# EAGLE design neopixel v1 (EAGLE 9.7.0)
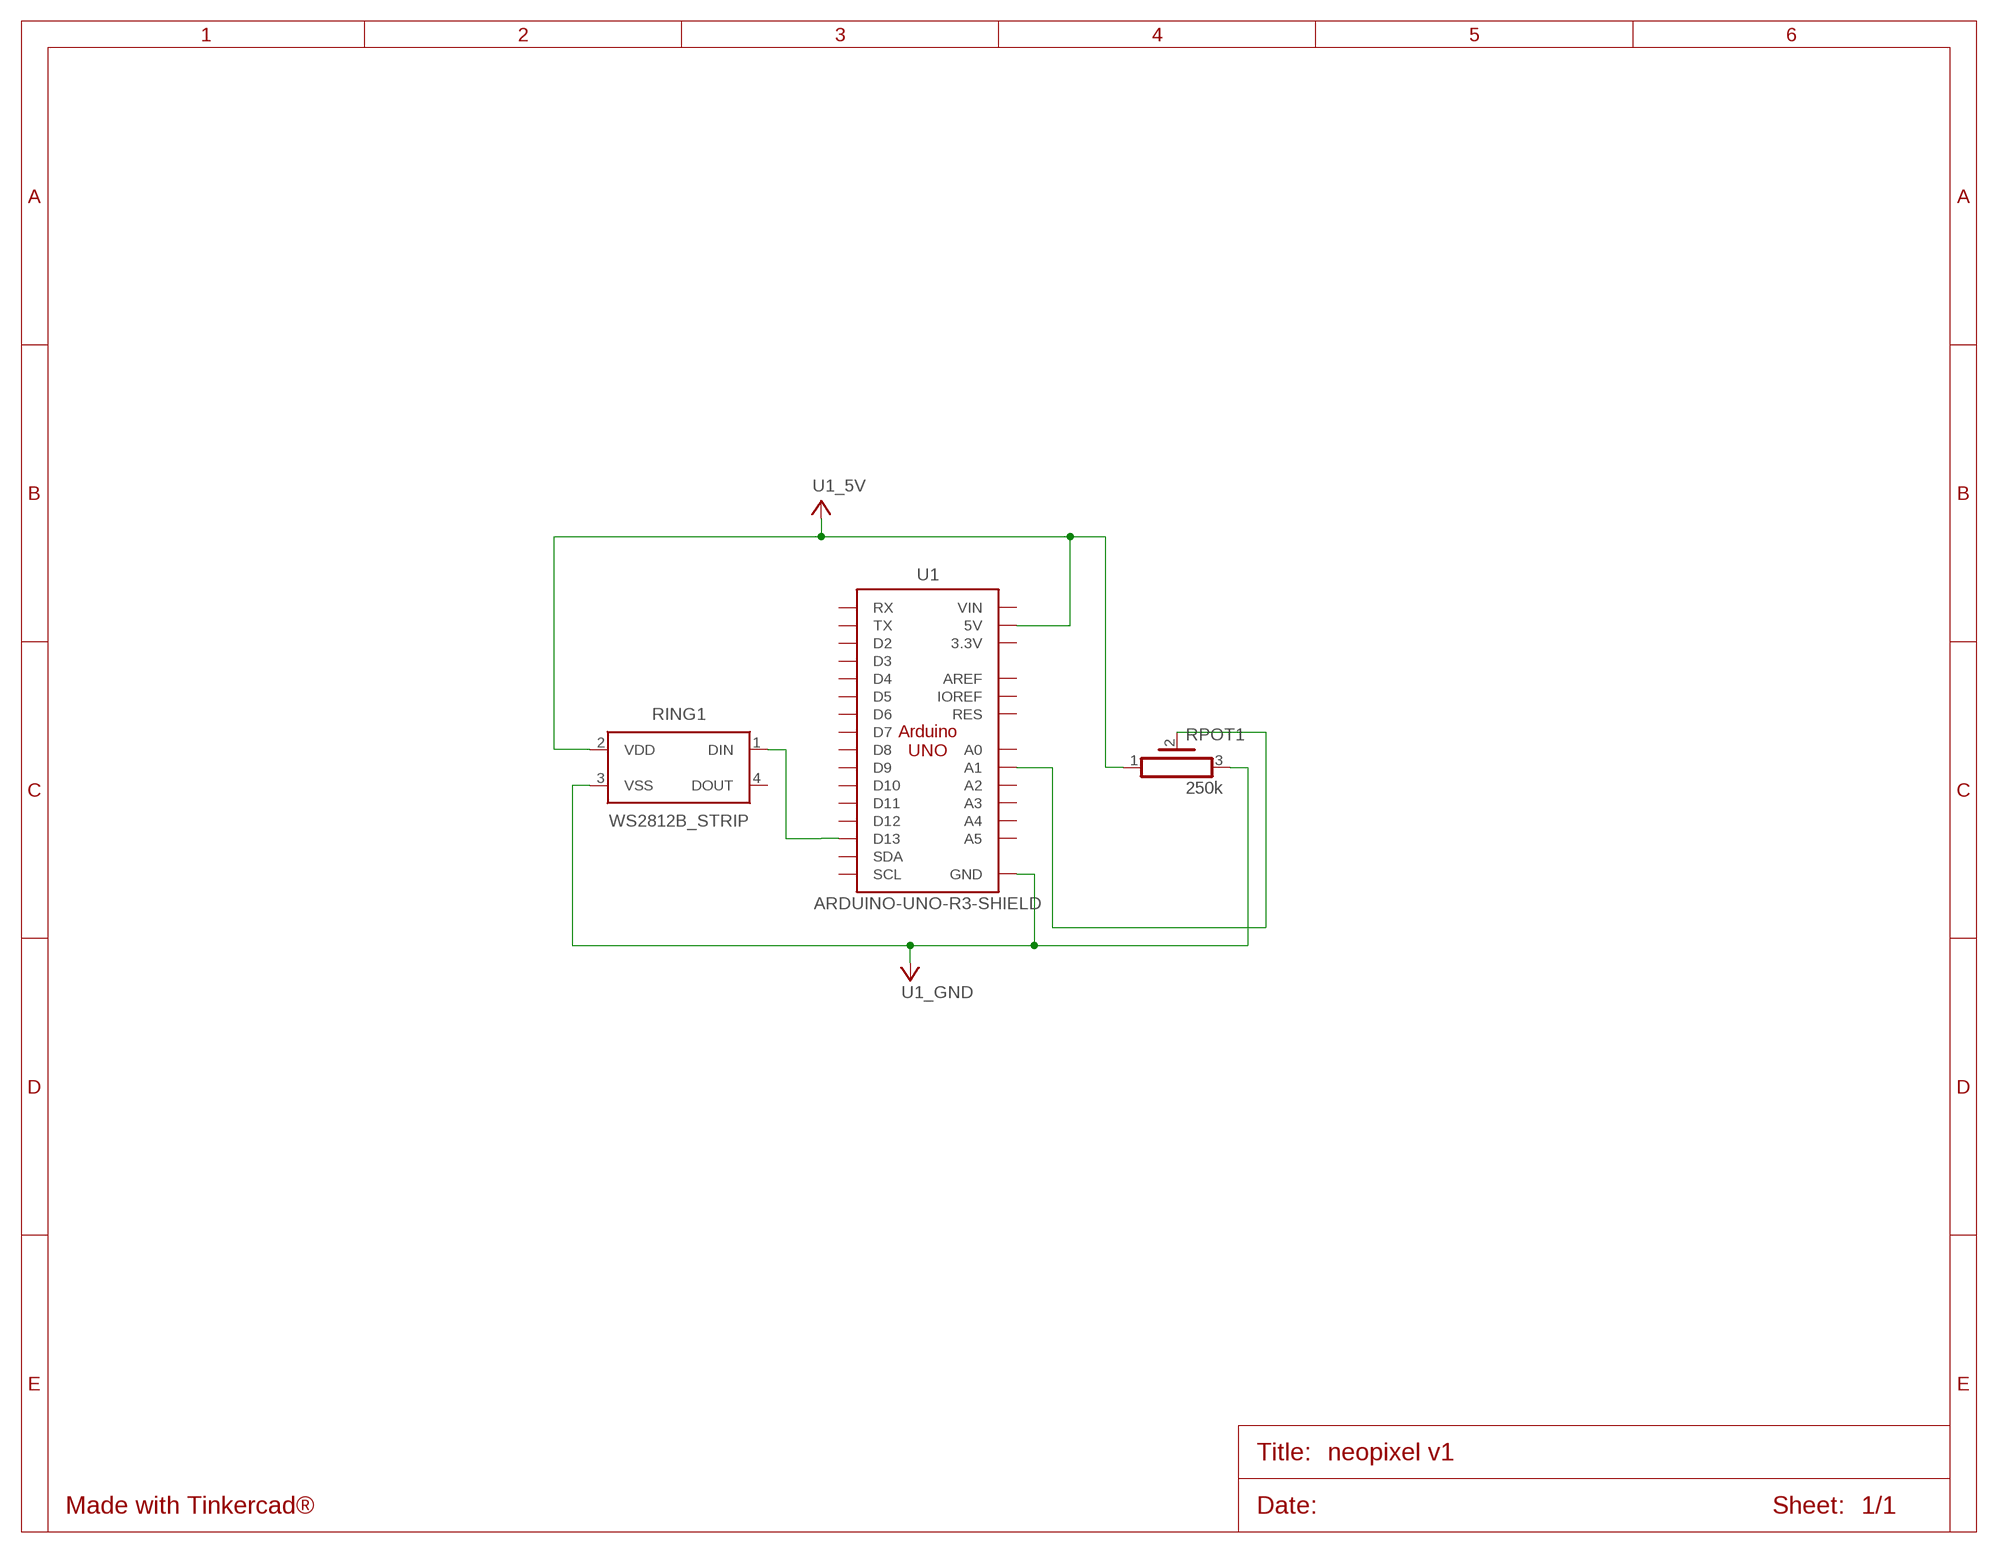
[diagram p0: schematic, sheet 1]

## Parts
RING1  WS2812B_STRIP  [WS2812-STRIP]
RPOT1  250k  POT_HA-06  [HA-06-SM065]
U1  ARDUINO-UNO-R3-SHIELD  [ARDUINO-UNO-R3-SHIELD]

## Nets
U1_5V: RING1.2(VDD) RPOT1.1 U1.5V
U1_A1: RPOT1.2 U1.A1
U1_D13: RING1.1(DIN) U1.D13
U1_GND: RING1.3(VSS) RPOT1.3 U1.GND@0(GND) U1.GND@1(GND) U1.GND@2(GND)
Unconnected: RING1.4(DOUT) U1.3.3V U1.A0 U1.A2 U1.A3 U1.A4 U1.A5 U1.AREF U1.D2 U1.D3 U1.D4 U1.D5 U1.D6 U1.D7 U1.D8 U1.D9 U1.D10 U1.D11 U1.D12 U1.IOREF U1.RES U1.RX U1.SCL U1.SDA U1.TX U1.VIN

## Library data of the parts
RING1 = Tinkercad:WS2812B: Intelligent control LED integrated light source Datasheet <http://cdn.sparkfun.com/datasheets/BreakoutBoards/WS2812B.pdf>
RPOT1 = Tinkercad:POT: Rectangular Trimmer Potentiometers - PV36 Series Datasheet <https://www.bourns.com/docs/Product-Datasheets/pv36.pdf>
U1 = Tinkercad:ARDUINO-UNO-R3-SHIELD

## Board
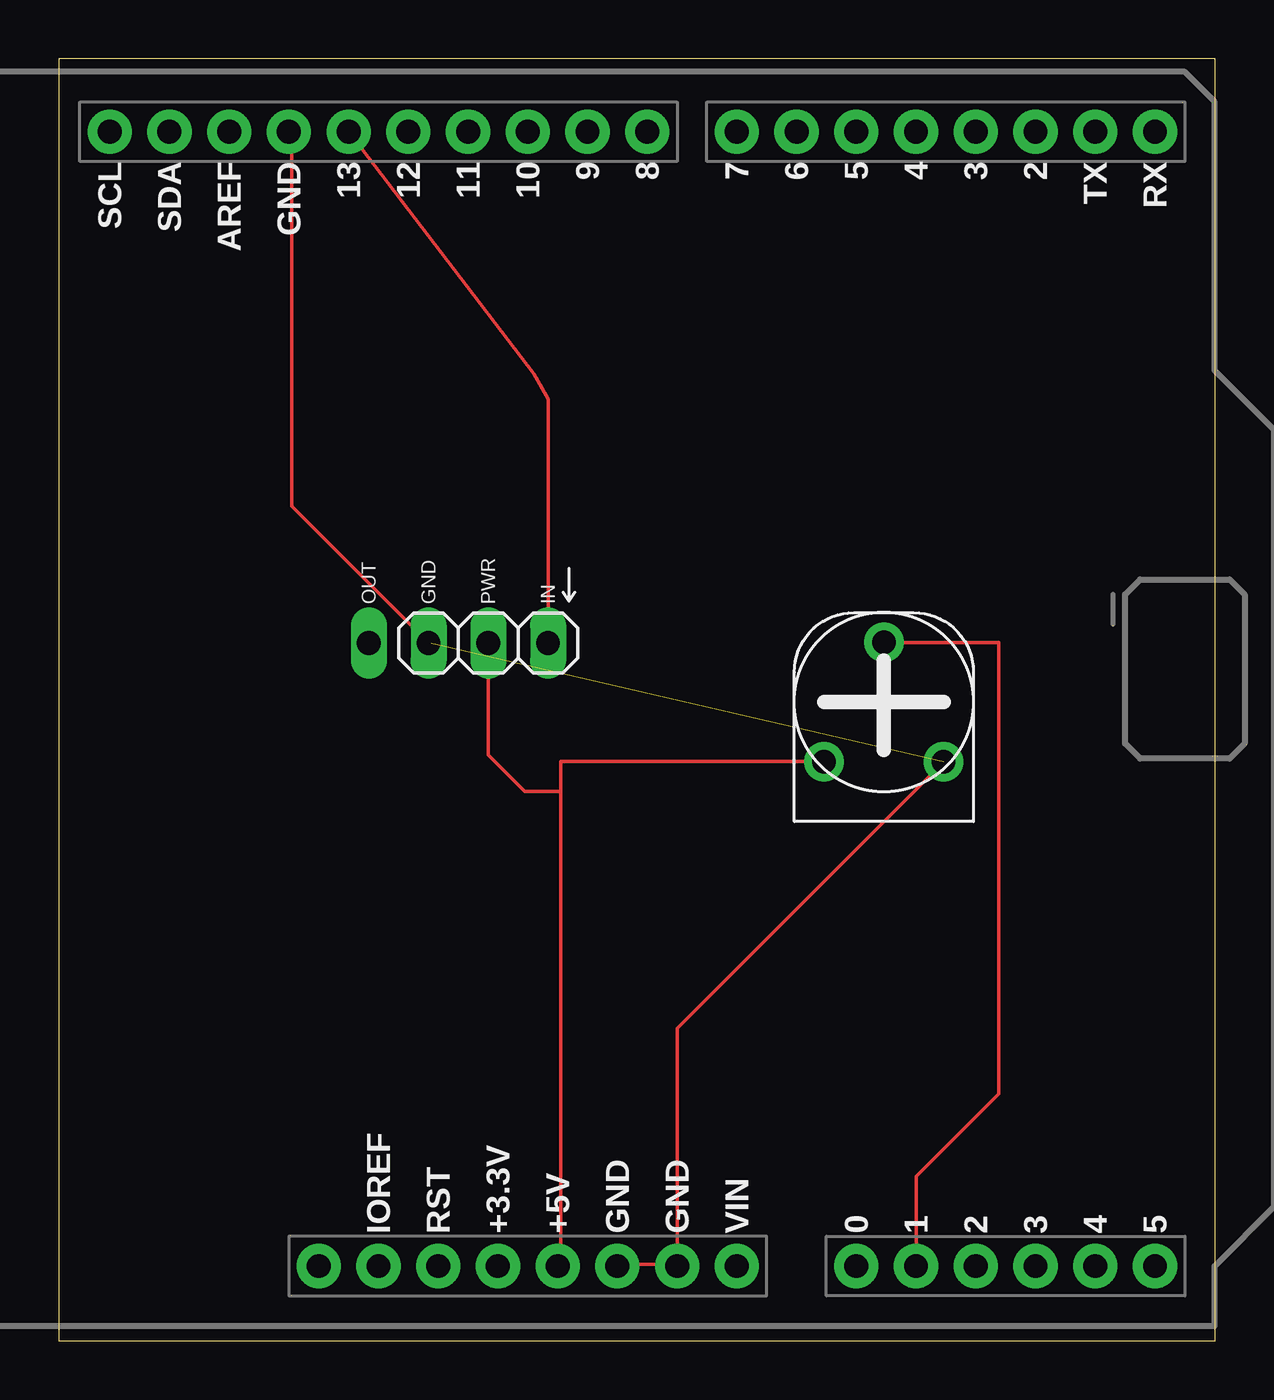
[diagram p1: board, top side]
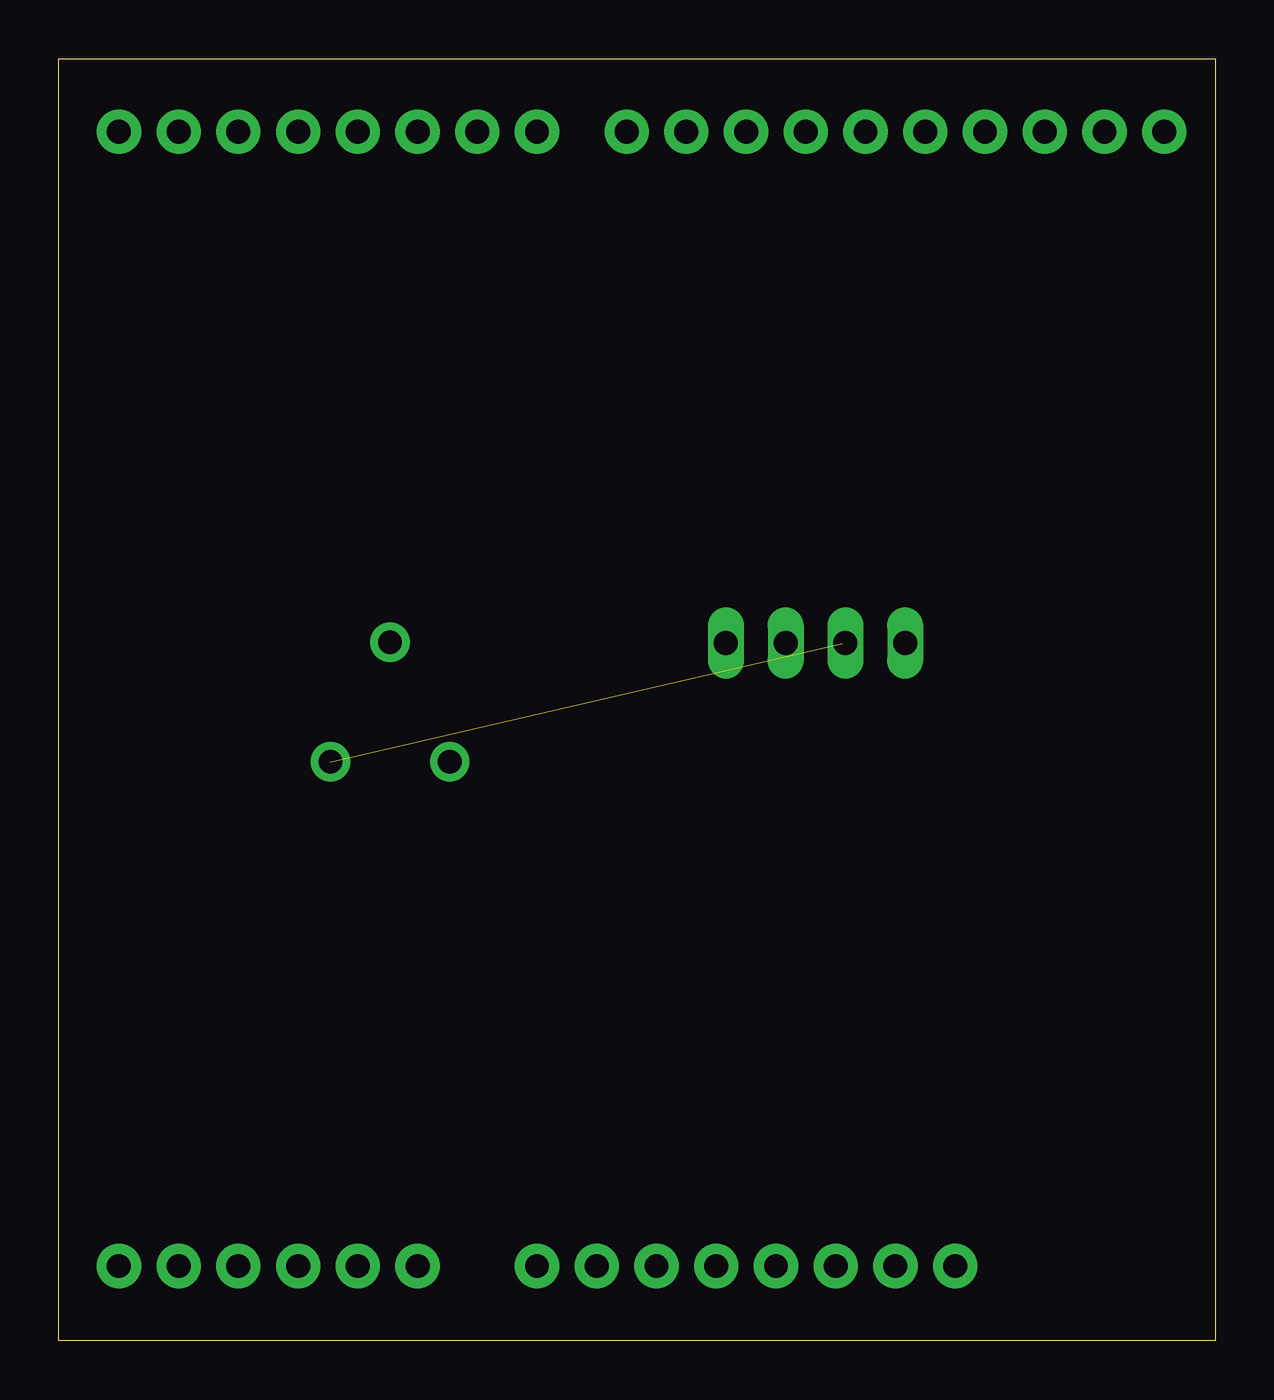
[diagram p2: board, bottom side, seen from below]

Size 49.17 x 54.54 mm. Coordinates in mm from the lower left corner, seen from the top.
Outline: 0,0 49.17,0 49.17,54.54 0,54.54 0,0
Copper layers (1*16): Top 0.035mm / dielectric 1.5mm / Bottom 0.035mm
Design rules "default": minimum track width 6mil, minimum drill 0.35mm, track to track 6mil, track to pad 6mil, pad to pad 6mil, via to via 6mil, smd to smd 6mil, copper to edge 40mil, drill to drill 6mil, minimum pad ring 10mil, minimum via ring 8mil, stop-mask expansion 4mil, vias tented up to drill 0mil, thermal gap 10mil

### Footprints (pad centres in the part's own frame; a part is rotated, then mirrored left to right if it is on the bottom)
WS2812-STRIP = drill 1.016 long: 1 -3.81,0; 2 -1.27,0; 3 1.27,0; 4 3.81,0
HA-06-SM065 = drill 1 pad 1.676: 1 -2.54,-2.54; 2 0,2.54; 3 2.54,-2.54
ARDUINO-UNO-R3-SHIELD = drill 1.016 pad 1.88: 3.3V 24.13,-2.54; 5V 24.13,0; A0 24.13,12.7; A1 24.13,15.24; A2 24.13,17.78; A3 24.13,20.32; A4 24.13,22.86; A5 24.13,25.4; AREF -24.13,-13.97; D2 -24.13,20.32; D3 -24.13,17.78; D4 -24.13,15.24; D5 -24.13,12.7; D6 -24.13,10.16; D7 -24.13,7.62; D8 -24.13,3.81; D9 -24.13,1.27; D10 -24.13,-1.27; D11 -24.13,-3.81; D12 -24.13,-6.35; D13 -24.13,-8.89; GND@0 24.13,2.54; GND@1 24.13,5.08; GND@2 -24.13,-11.43; IOREF 24.13,-7.62; NC 24.13,-10.16; RES 24.13,-5.08; RX -24.13,25.4; SCL -24.13,-19.05; SDA -24.13,-16.51; TX -24.13,22.86; VIN 24.13,7.62

### Placement (x,y rotation side)
RING1  16.99,29.68 180 top
RPOT1  35.09,27.17 0 top
U1  21.21,27.3 270 top

### Tracks (layer width: path | path; a pad name or v marks a point on that pad's centre or on a via)
U1_5V
  Top 0.152: RPOT1.1 32.54,24.64 21.34,24.64 21.34,23.37 | 21.34,23.37 19.81,23.37 18.26,24.92 RING1.2 | 21.34,23.37 21.34,3.25 U1.5V
U1_A1
  Top 0.152: U1.A1 36.45,6.99 39.96,10.49 39.96,29.71 RPOT1.2
U1_D13
  Top 0.152: 20.19,41.14 | RING1.1 20.8,40.07 20.19,41.14 | U1.D13 20.19,41.14
U1_GND  (1 unrouted)
  Top 0.152: U1.GND@0 23.77,3.25 26.21,3.25 U1.GND@1 26.3,13.3 RPOT1.3 | U1.GND@2 9.91,51.41 9.91,35.5 RING1.3
  Bottom 0.152: 15.85,29.67 RING1.3 | 23.77,3.25 U1.GND@0